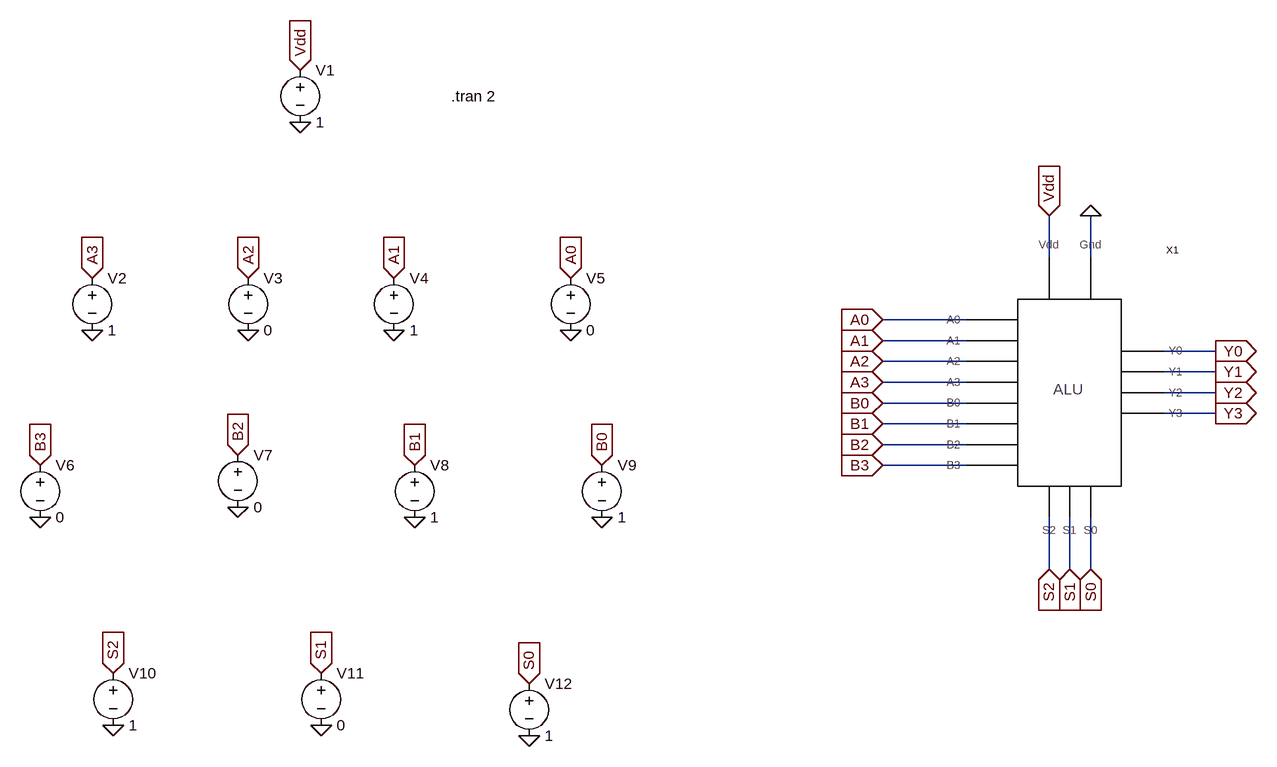
[diagram p0: schematic ALU_Test.asc]
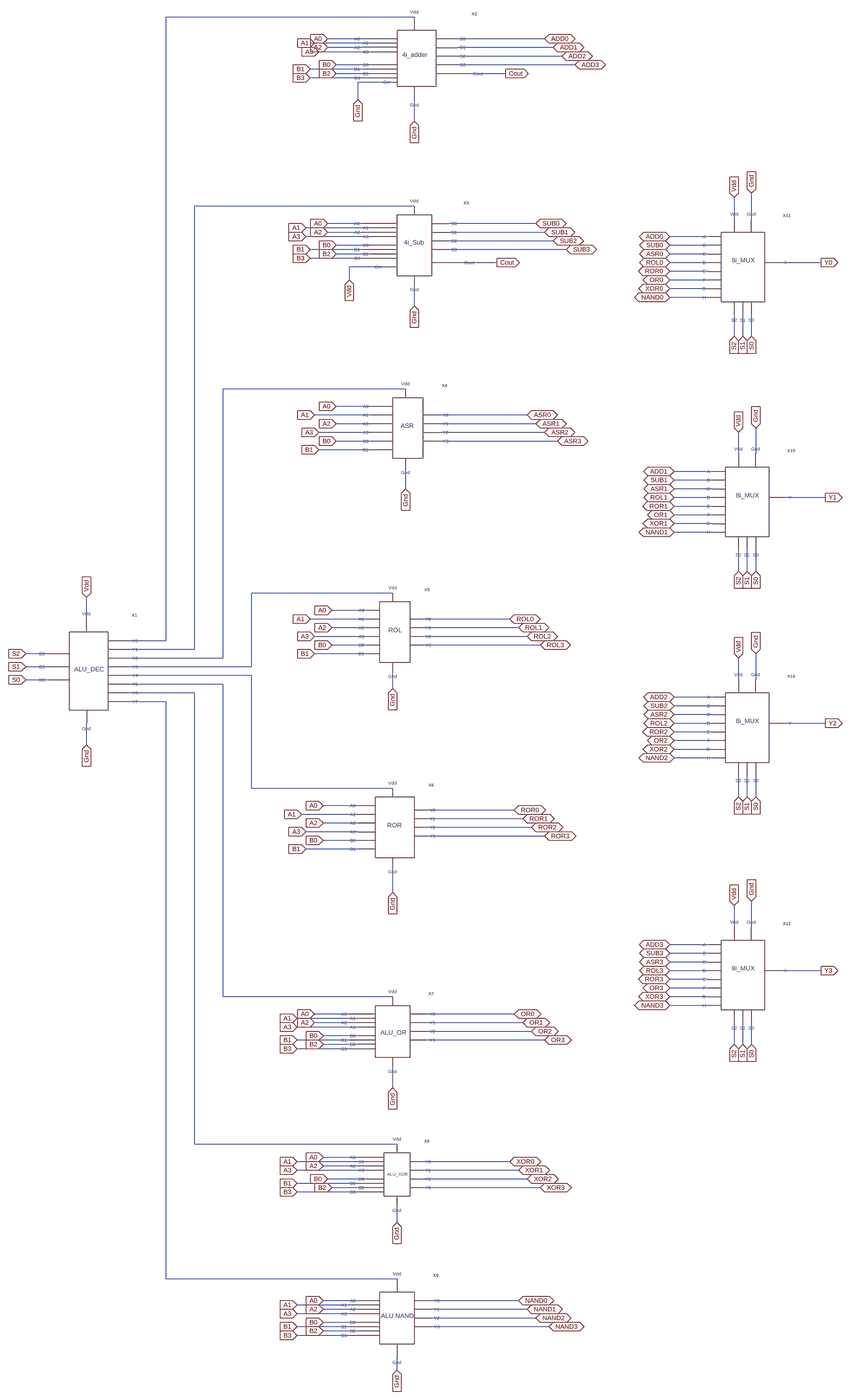
[diagram p1: sub-circuit alu.asc, whole sheet]
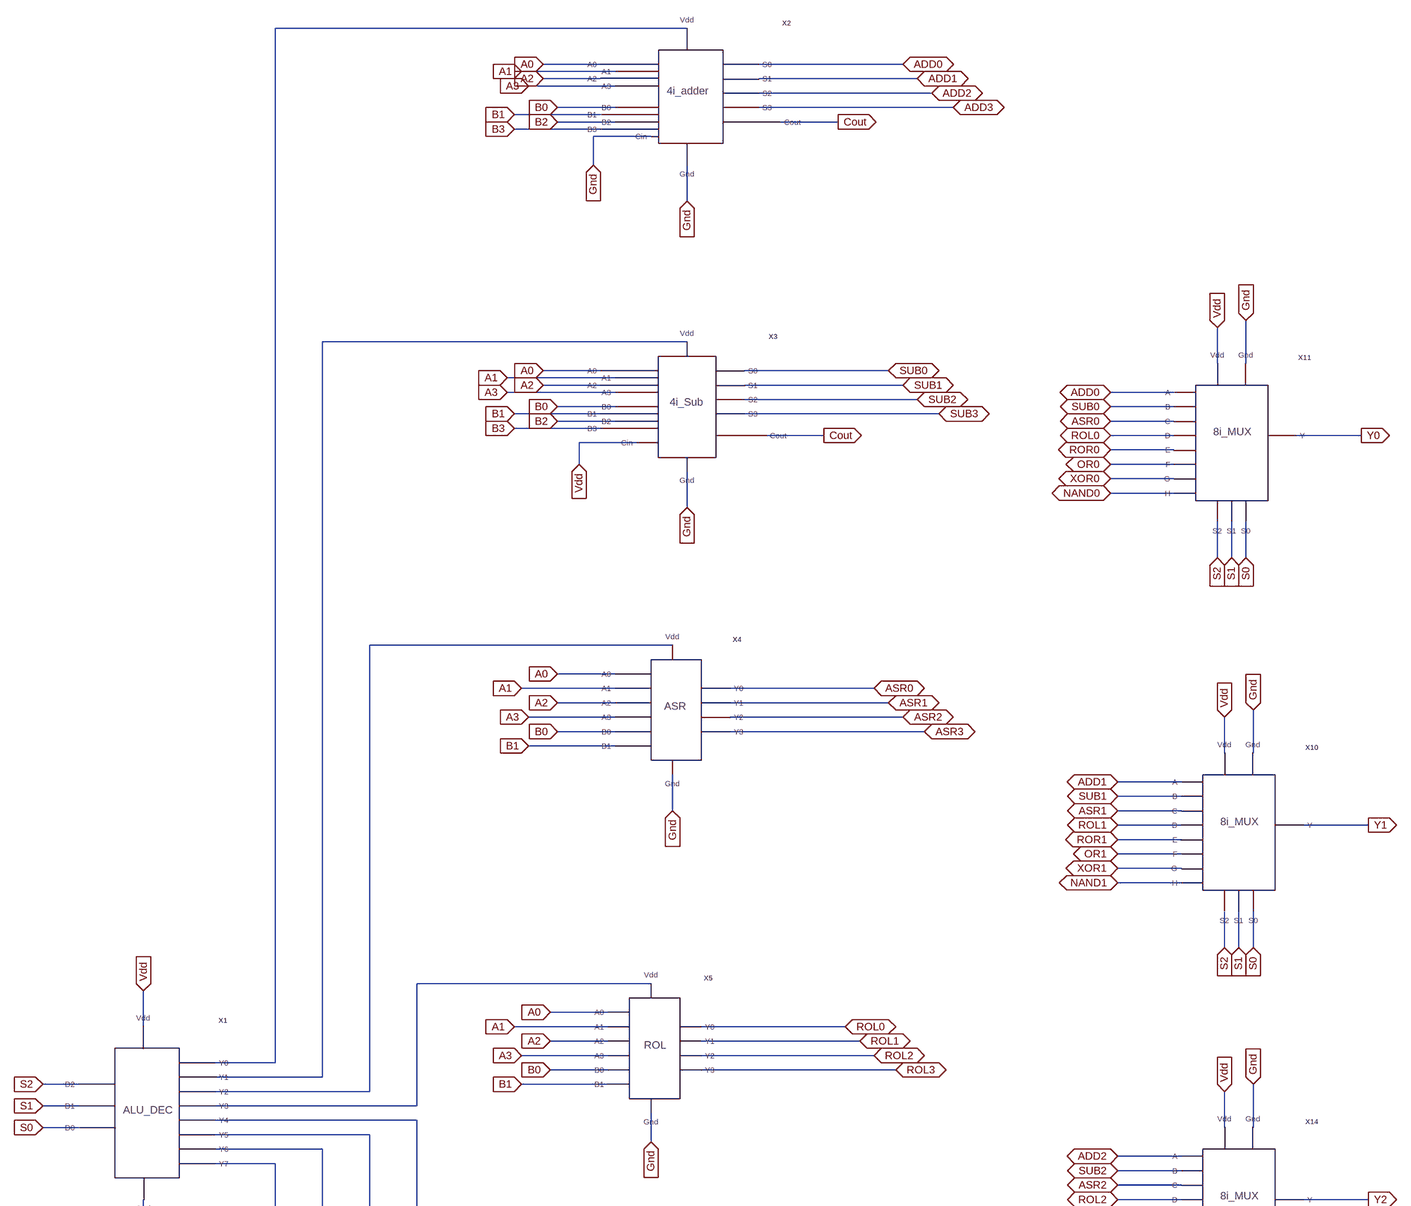
[diagram p2: sub-circuit alu.asc, part, row 1 of 2, column 1 of 1]
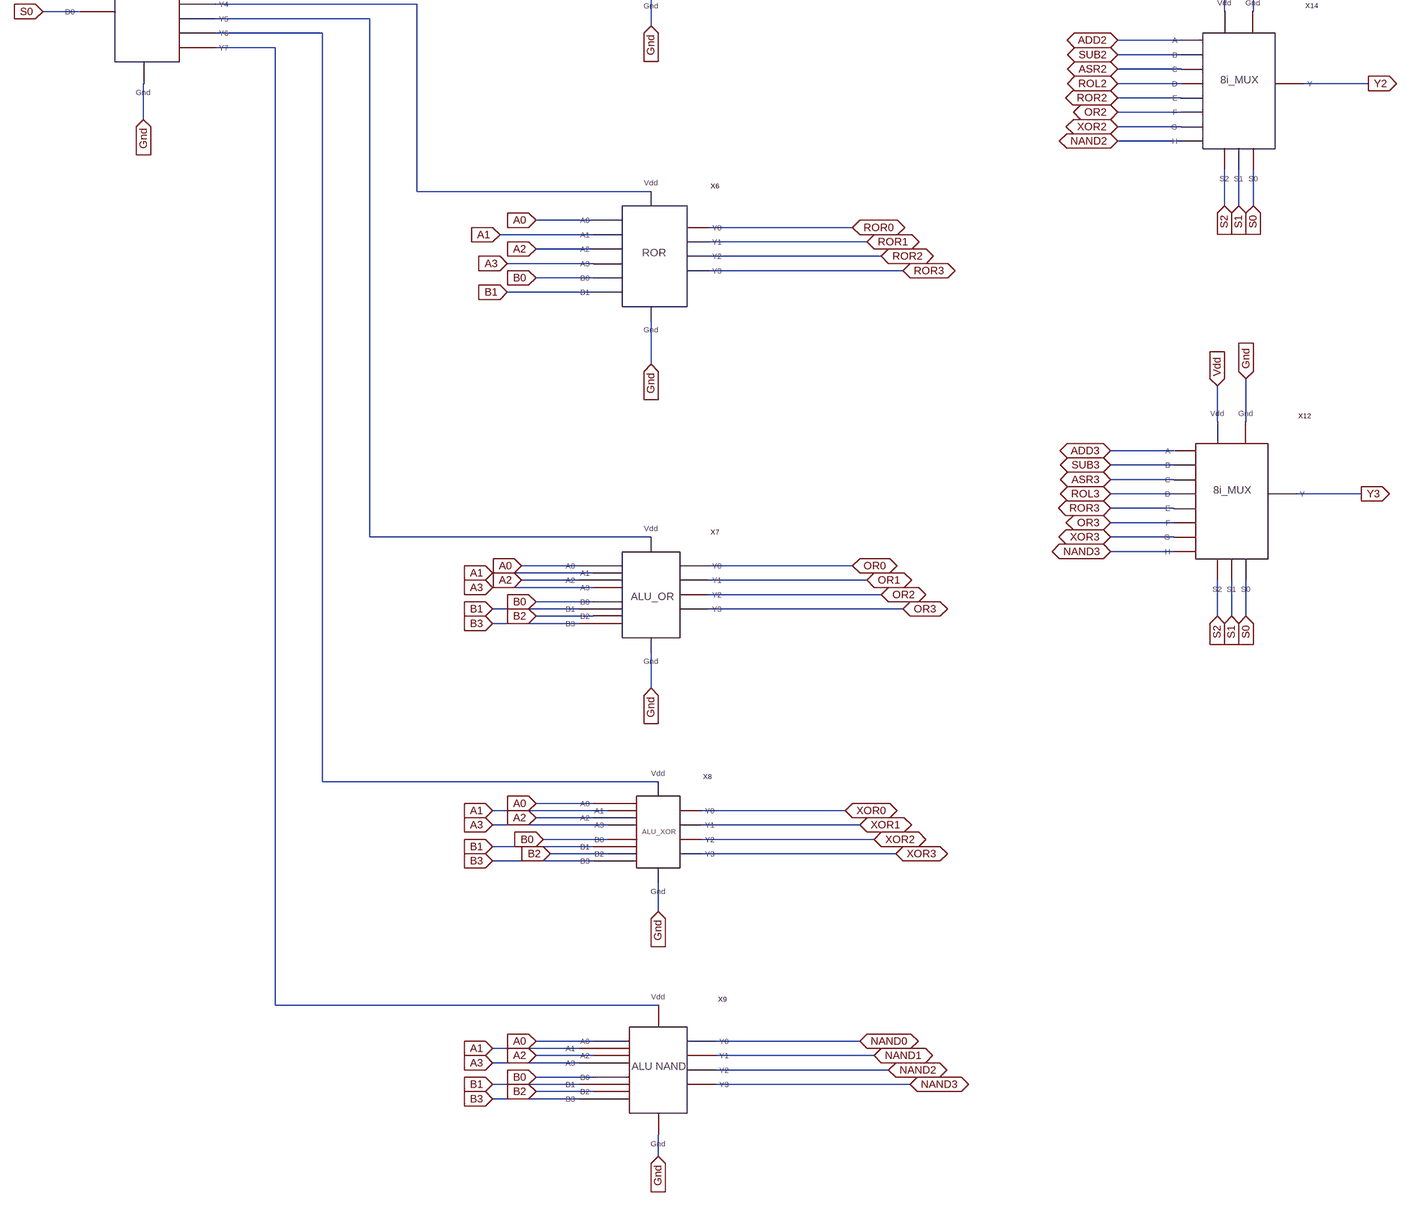
[diagram p3: sub-circuit alu.asc, part, row 2 of 2, column 1 of 1]
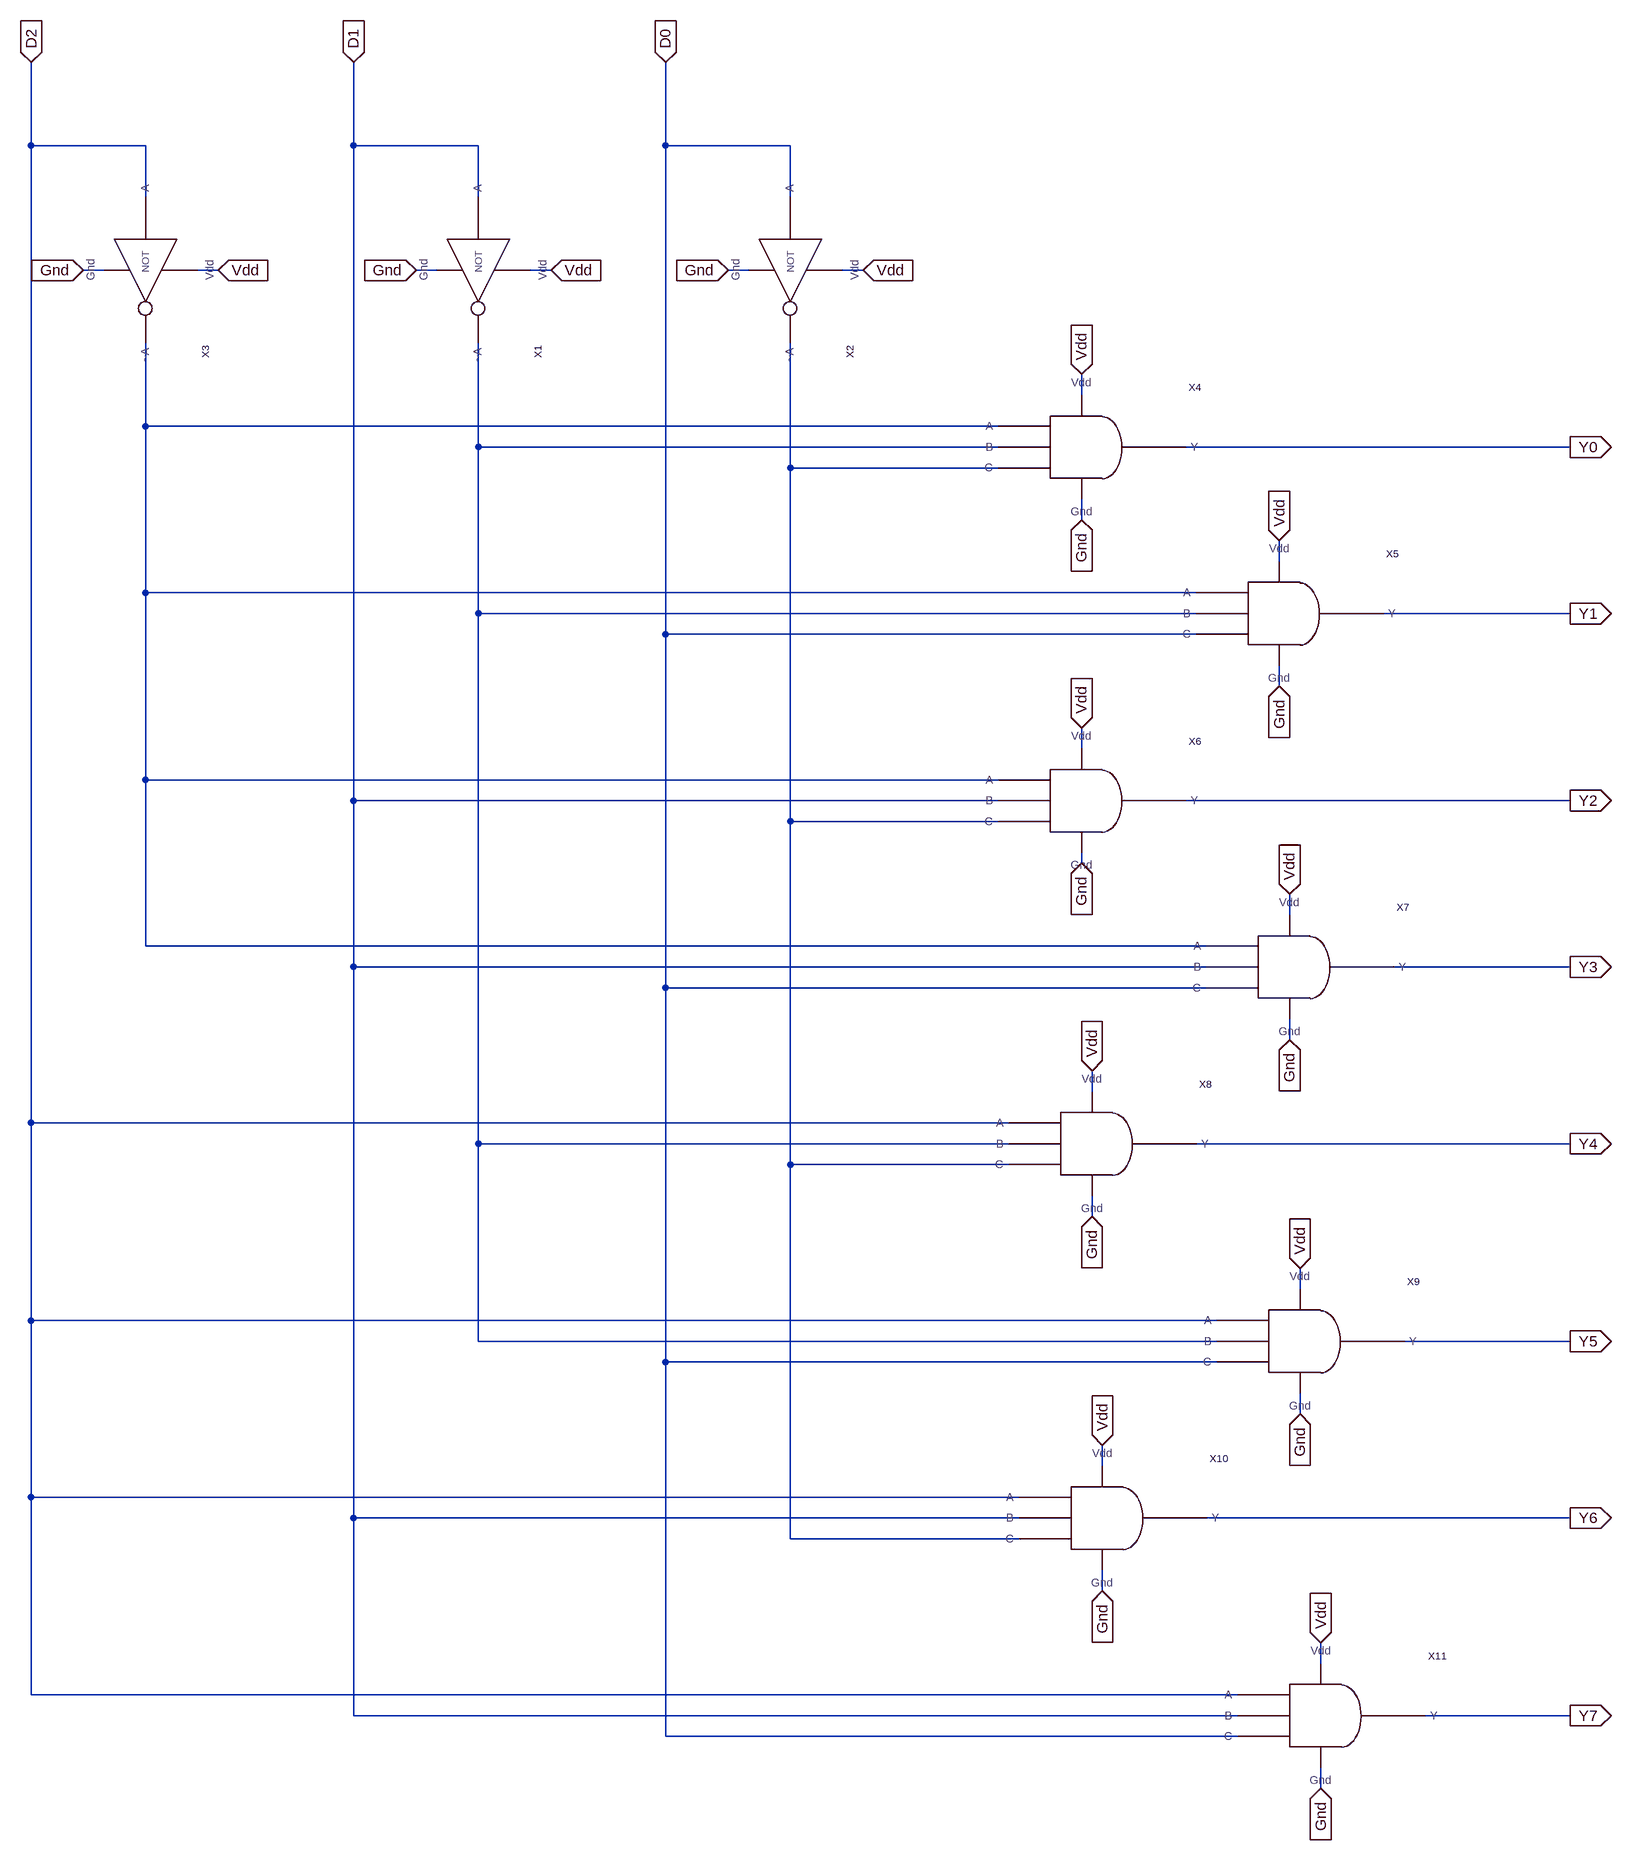
[diagram p4: sub-circuit alu_dec.asc]
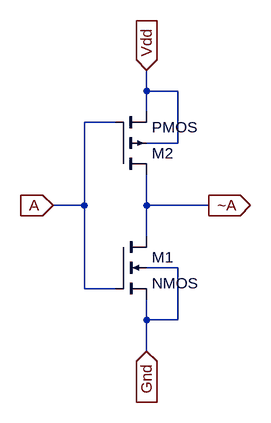
[diagram p5: sub-circuit not.asc]
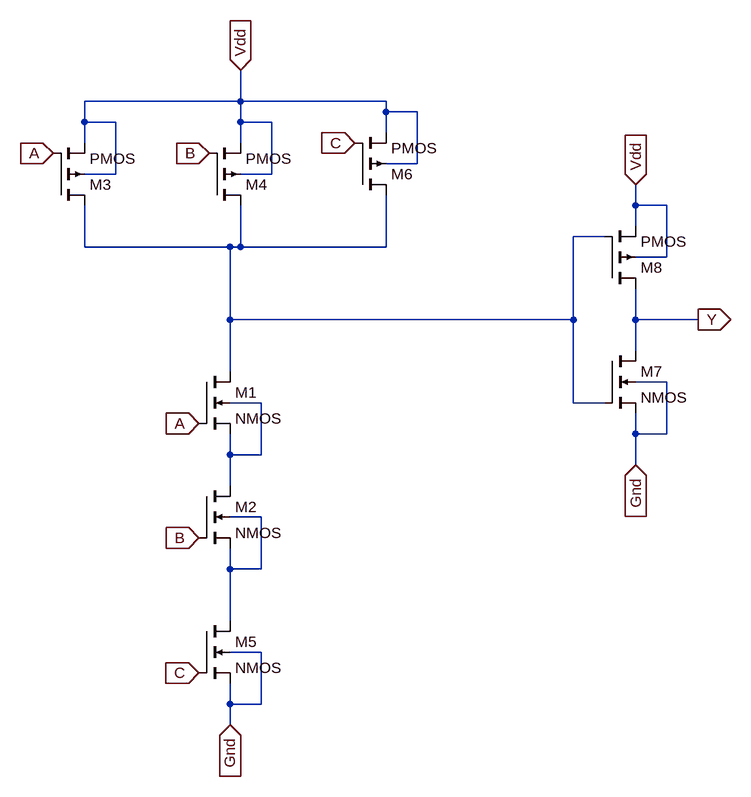
[diagram p6: sub-circuit 3iand.asc]
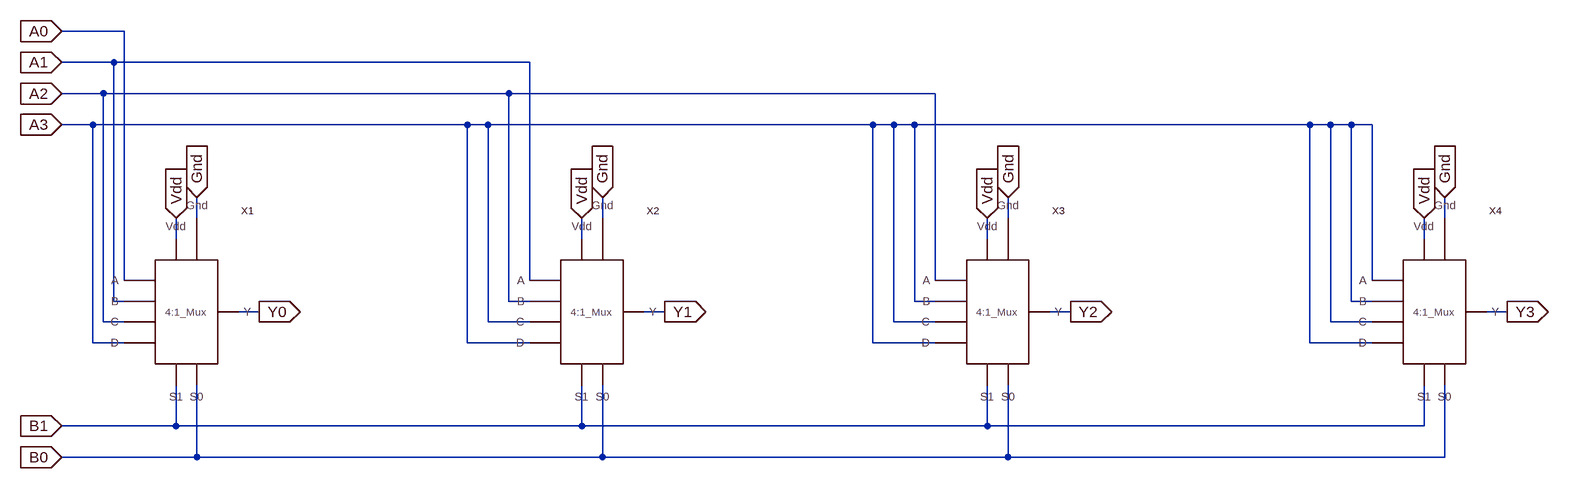
[diagram p7: sub-circuit alu_asr.asc]
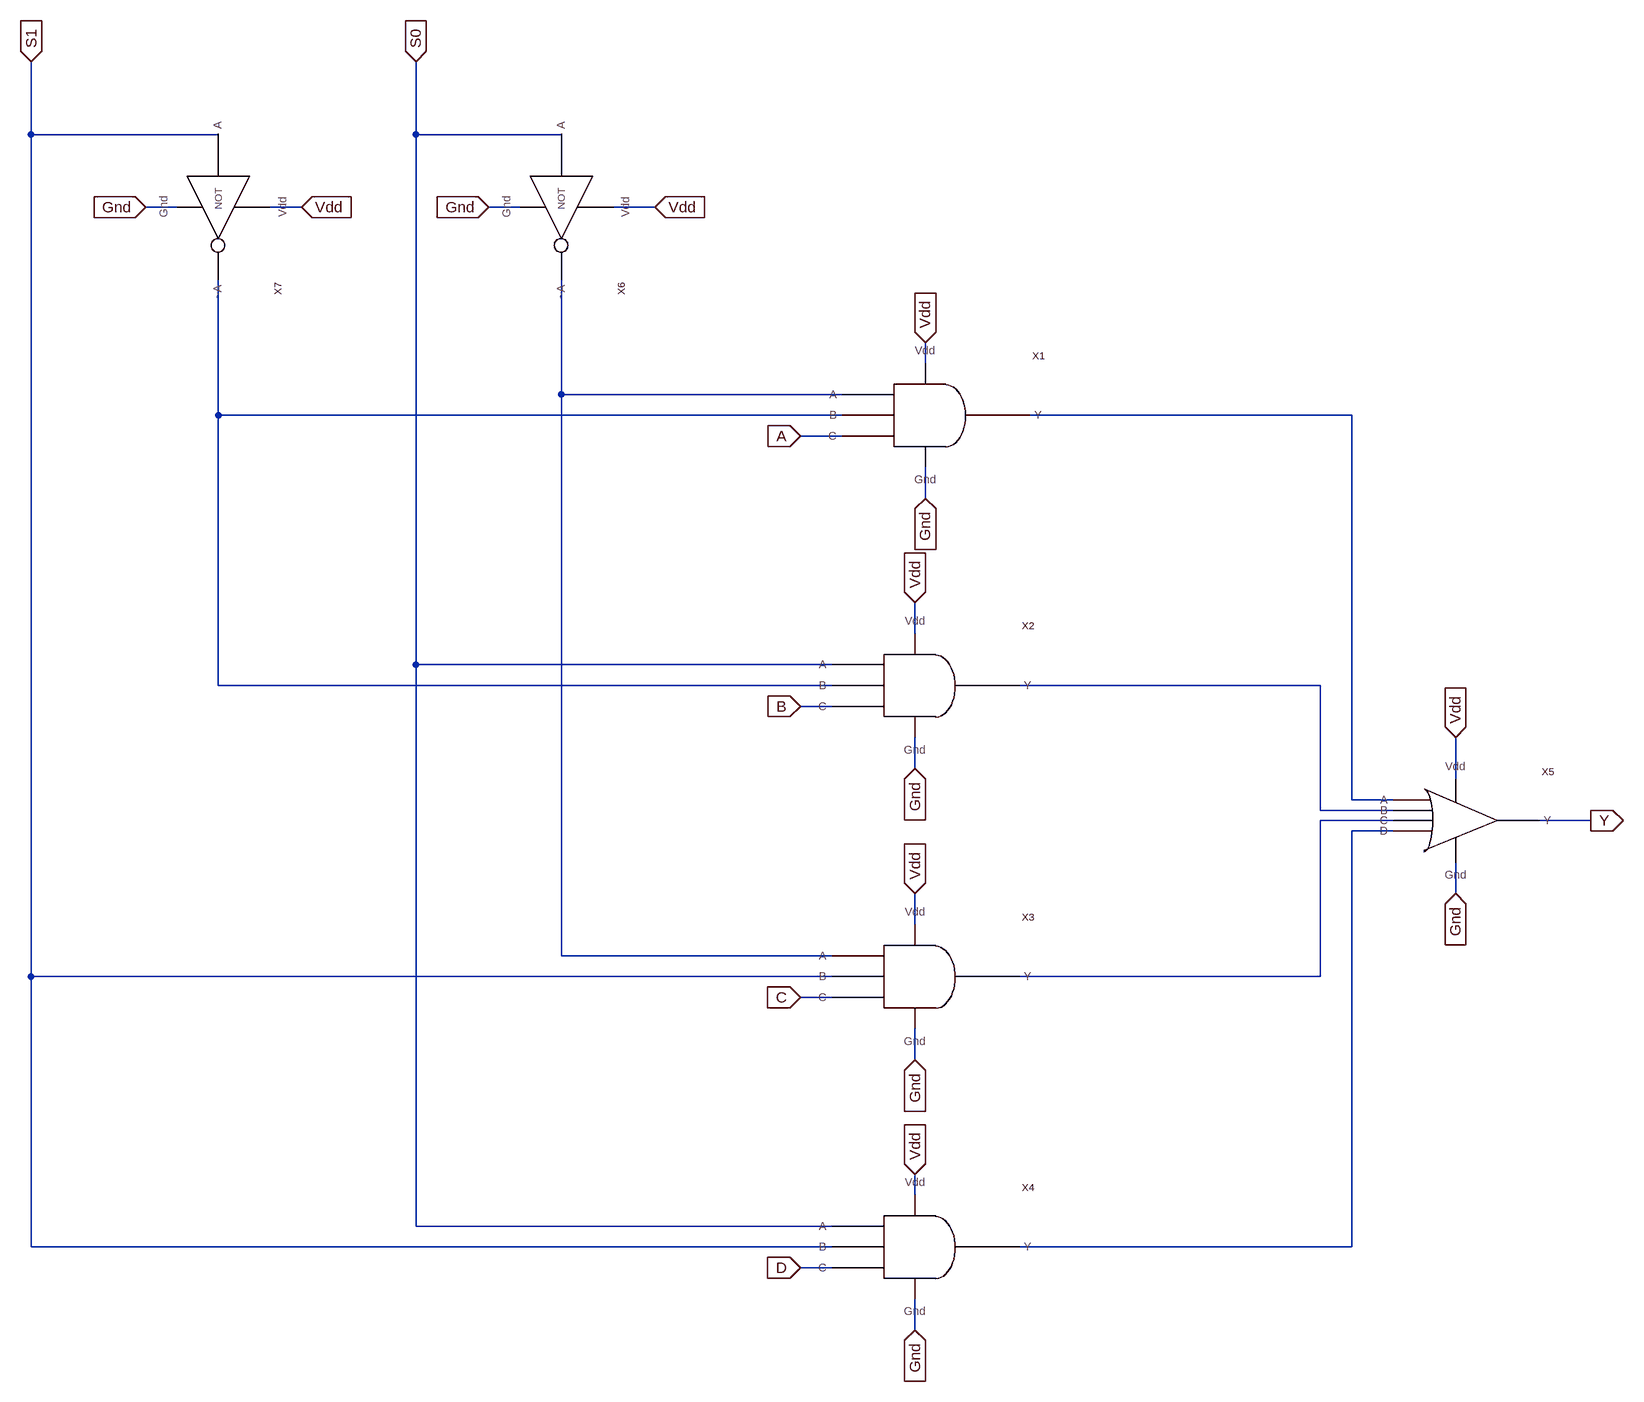
[diagram p8: sub-circuit 41_mux.asc]
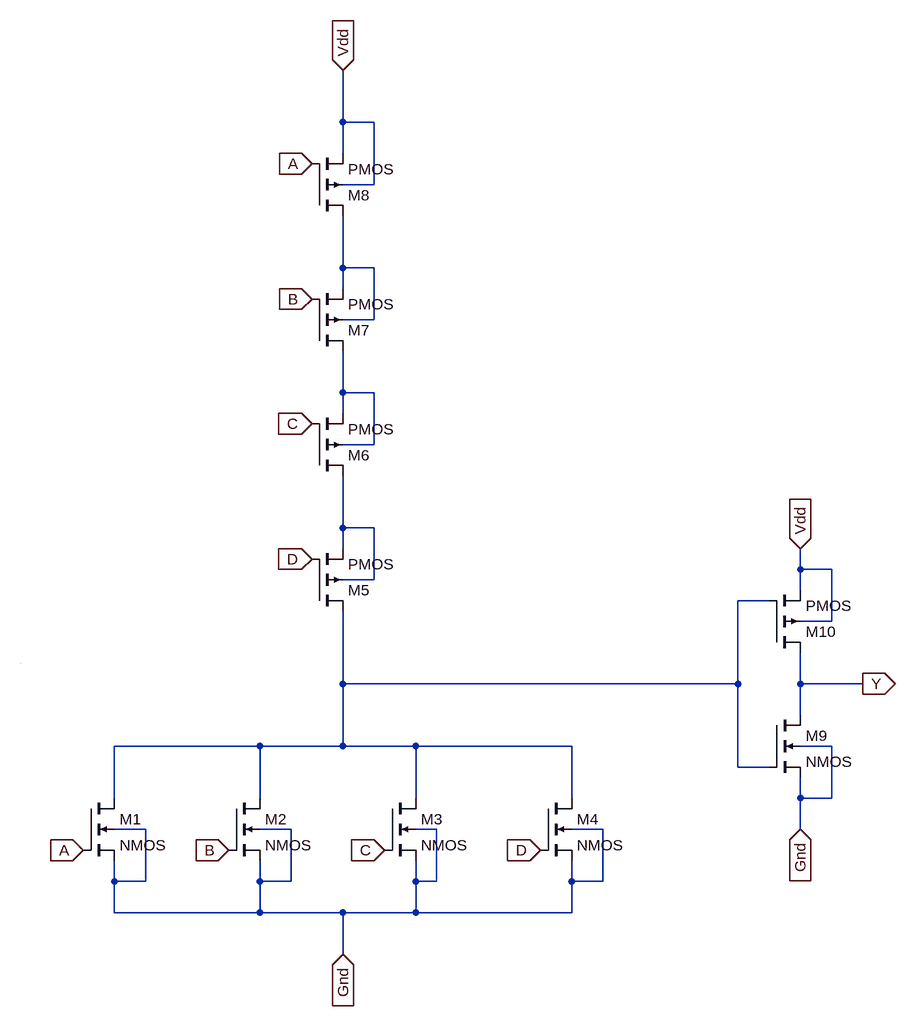
[diagram p9: sub-circuit 4i_or.asc]
ALU_Test.asc, the LTspice schematic file:
Version 4
SHEET 1 880 868
WIRE 368 -32 368 -96
WIRE 432 -32 432 -96
WIRE 240 64 112 64
WIRE 240 96 112 96
WIRE 624 112 544 112
WIRE 240 128 112 128
WIRE 624 144 544 144
WIRE 240 160 112 160
WIRE 624 176 544 176
WIRE 240 192 112 192
WIRE 624 208 544 208
WIRE 240 224 112 224
WIRE 240 256 112 256
WIRE 240 288 112 288
WIRE 368 448 368 368
WIRE 400 448 400 368
WIRE 432 448 432 368
FLAG -784 -320 Vdd
IOPIN -784 -320 In
FLAG -368 0 A0
IOPIN -368 0 In
FLAG -640 0 A1
IOPIN -640 0 In
FLAG -864 0 A2
IOPIN -864 0 In
FLAG -1104 0 A3
IOPIN -1104 0 In
FLAG -784 -240 0
FLAG -1104 80 0
FLAG -864 80 0
FLAG -640 80 0
FLAG -368 80 0
FLAG -608 288 B1
IOPIN -608 288 In
FLAG -880 272 B2
IOPIN -880 272 In
FLAG -1184 288 B3
IOPIN -1184 288 In
FLAG -320 288 B0
IOPIN -320 288 In
FLAG -1184 368 0
FLAG -880 352 0
FLAG -608 368 0
FLAG -320 368 0
FLAG -432 624 S0
IOPIN -432 624 In
FLAG -752 608 S1
IOPIN -752 608 In
FLAG -1072 608 S2
IOPIN -1072 608 In
FLAG -1072 688 0
FLAG -752 688 0
FLAG -432 704 0
FLAG 368 -96 Vdd
IOPIN 368 -96 In
FLAG 112 64 A0
IOPIN 112 64 In
FLAG 112 96 A1
IOPIN 112 96 In
FLAG 112 128 A2
IOPIN 112 128 In
FLAG 112 160 A3
IOPIN 112 160 In
FLAG 112 192 B0
IOPIN 112 192 In
FLAG 112 224 B1
IOPIN 112 224 In
FLAG 112 256 B2
IOPIN 112 256 In
FLAG 112 288 B3
IOPIN 112 288 In
FLAG 432 448 S0
IOPIN 432 448 In
FLAG 400 448 S1
IOPIN 400 448 In
FLAG 368 448 S2
IOPIN 368 448 In
FLAG 624 112 Y0
IOPIN 624 112 Out
FLAG 624 144 Y1
IOPIN 624 144 Out
FLAG 624 176 Y2
IOPIN 624 176 Out
FLAG 624 208 Y3
IOPIN 624 208 Out
FLAG 432 -96 0
SYMBOL ALU 400 96 R0
SYMATTR InstName X1
SYMBOL voltage -784 -336 R0
WINDOW 123 0 0 Left 0
WINDOW 39 0 0 Left 0
SYMATTR InstName V1
SYMATTR Value 1
SYMBOL voltage -1104 -16 R0
WINDOW 123 0 0 Left 0
WINDOW 39 0 0 Left 0
SYMATTR InstName V2
SYMATTR Value 1
SYMBOL voltage -864 -16 R0
WINDOW 123 0 0 Left 0
WINDOW 39 0 0 Left 0
SYMATTR InstName V3
SYMATTR Value 0
SYMBOL voltage -640 -16 R0
WINDOW 123 0 0 Left 0
WINDOW 39 0 0 Left 0
SYMATTR InstName V4
SYMATTR Value 1
SYMBOL voltage -368 -16 R0
WINDOW 123 0 0 Left 0
WINDOW 39 0 0 Left 0
SYMATTR InstName V5
SYMATTR Value 0
SYMBOL voltage -1184 272 R0
WINDOW 123 0 0 Left 0
WINDOW 39 0 0 Left 0
SYMATTR InstName V6
SYMATTR Value 0
SYMBOL voltage -880 256 R0
WINDOW 123 0 0 Left 0
WINDOW 39 0 0 Left 0
SYMATTR InstName V7
SYMATTR Value 0
SYMBOL voltage -608 272 R0
WINDOW 123 0 0 Left 0
WINDOW 39 0 0 Left 0
SYMATTR InstName V8
SYMATTR Value 1
SYMBOL voltage -320 272 R0
WINDOW 123 0 0 Left 0
WINDOW 39 0 0 Left 0
SYMATTR InstName V9
SYMATTR Value 1
SYMBOL voltage -1072 592 R0
WINDOW 123 0 0 Left 0
WINDOW 39 0 0 Left 0
SYMATTR InstName V10
SYMATTR Value 1
SYMBOL voltage -752 592 R0
WINDOW 123 0 0 Left 0
WINDOW 39 0 0 Left 0
SYMATTR InstName V11
SYMATTR Value 0
SYMBOL voltage -432 608 R0
WINDOW 123 0 0 Left 0
WINDOW 39 0 0 Left 0
SYMATTR InstName V12
SYMATTR Value 1
TEXT -552 -280 Left 2 !.tran 2

The netlist it stands for:
* ALU_Test.asc
XX1 A0 A1 A2 A3 B0 B1 B2 B3 S0 S1 S2 Vdd 0 Y0 Y1 Y2 Y3 alu
V1 Vdd 0 1
V2 A3 0 1
V3 A2 0 0
V4 A1 0 1
V5 A0 0 0
V6 B3 0 0
V7 B2 0 0
V8 B1 0 1
V9 B0 0 1
V10 S2 0 1
V11 S1 0 0
V12 S0 0 1

* block symbol definitions
.subckt alu A0 A1 A2 A3 B0 B1 B2 B3 S0 S1 S2 Vdd Gnd Y0 Y1 Y2 Y3
XX1 S0 S1 S2 Vdd Gnd N001 N002 N003 N004 N005 N006 N007 N008 alu_dec
XX2 A0 A1 A2 A3 B0 B1 B2 B3 Gnd N001 ADD0 ADD1 ADD2 ADD3 Cout Gnd ALU_ADD  ; pins A0 A1 A2 A3 B0 B1 B2 B3 Gnd Vdd S0 S1 S2 S3 Cout Cin
XX3 A0 A1 A2 A3 B0 B1 B2 B3 Vdd N002 Gnd SUB0 SUB1 SUB2 SUB3 Cout ALU_SUB  ; pins A0 A1 A2 A3 B0 B1 B2 B3 Cin Vdd Gnd S0 S1 S2 S3 Cout
XX4 A0 A1 A2 A3 B0 B1 N003 Gnd ASR0 ASR1 ASR2 ASR3 alu_asr
XX5 A0 A1 A2 A3 B0 B1 N004 Gnd ROL0 ROL1 ROL2 ROL3 alu_rol
XX6 A0 A1 A2 A3 B0 B1 Gnd N005 ROR0 ROR1 ROR2 ROR3 alu_ror
XX7 A0 A1 A2 A3 B0 B1 B2 B3 N006 Gnd OR0 OR1 OR2 OR3 alu_or
XX8 A0 A1 A2 A3 B0 B1 B2 B3 N007 Gnd XOR0 XOR1 XOR2 XOR3 alu_xor
XX9 A0 A1 A2 A3 B0 B1 B2 B3 NAND0 NAND1 NAND2 NAND3 N008 Gnd alu_nand
XX11 ADD0 SUB0 ASR0 ROL0 ROR0 OR0 XOR0 NAND0 S0 S1 S2 Y0 Vdd Gnd alu_mux
XX10 ADD1 SUB1 ASR1 ROL1 ROR1 OR1 XOR1 NAND1 S0 S1 S2 Y1 Vdd Gnd alu_mux
XX14 ADD2 SUB2 ASR2 ROL2 ROR2 OR2 XOR2 NAND2 S0 S1 S2 Y2 Vdd Gnd alu_mux
XX12 ADD3 SUB3 ASR3 ROL3 ROR3 OR3 XOR3 NAND3 S0 S1 S2 Y3 Vdd Gnd alu_mux
.ends alu

.subckt alu_dec D0 D1 D2 Vdd Gnd Y0 Y1 Y2 Y3 Y4 Y5 Y6 Y7
XX1 D1 N002 Vdd Gnd not
XX2 D0 N003 Vdd Gnd not
XX3 D2 N001 Vdd Gnd not
XX4 N001 N002 N003 Vdd Gnd Y0 3iand
XX5 N001 N002 D0 Vdd Gnd Y1 3iand
XX6 N001 D1 N003 Vdd Gnd Y2 3iand
XX7 N001 D1 D0 Vdd Gnd Y3 3iand
XX8 D2 N002 N003 Vdd Gnd Y4 3iand
XX9 D2 N002 D0 Vdd Gnd Y5 3iand
XX10 D2 D1 N003 Vdd Gnd Y6 3iand
XX11 D2 D1 D0 Vdd Gnd Y7 3iand
.ends alu_dec

.subckt not A ~A Vdd Gnd
M1 ~A A Gnd Gnd NMOS
M2 ~A A Vdd Vdd PMOS
.ends not

.subckt 3iand A B C Vdd Gnd Y
M1 N001 A N002 N002 NMOS
M2 N002 B N003 N003 NMOS
M3 N001 A Vdd Vdd PMOS
M4 N001 B Vdd Vdd PMOS
M5 N003 C Gnd Gnd NMOS
M6 N001 C Vdd Vdd PMOS
M7 Y N001 Gnd Gnd NMOS
M8 Y N001 Vdd Vdd PMOS
.ends 3iand

.subckt alu_asr A0 A1 A2 A3 B0 B1 Vdd Gnd Y0 Y1 Y2 Y3
XX1 A0 A1 A2 A3 B0 B1 Y0 Vdd Gnd 41_mux
XX2 A1 A2 A3 A3 B0 B1 Y1 Vdd Gnd 41_mux
XX3 A2 A3 A3 A3 B0 B1 Y2 Vdd Gnd 41_mux
XX4 A3 A3 A3 A3 B0 B1 Y3 Vdd Gnd 41_mux
.ends alu_asr

.subckt 41_mux A B C D S0 S1 Y Vdd Gnd
XX1 N001 N002 A Vdd Gnd N003 3iand
XX2 S0 N002 B Vdd Gnd N004 3iand
XX3 N001 S1 C Vdd Gnd N005 3iand
XX4 S0 S1 D Vdd Gnd N006 3iand
XX5 N003 N004 N005 N006 Vdd Gnd Y 4i_or
XX6 S0 N001 Vdd Gnd not
XX7 S1 N002 Vdd Gnd not
.ends 41_mux

.subckt 4i_or A B C D Vdd Gnd Y
M1 N004 A Gnd Gnd NMOS
M2 N004 B Gnd Gnd NMOS
M3 N004 C Gnd Gnd NMOS
M4 N004 D Gnd Gnd NMOS
M5 N004 D N003 N003 PMOS
M6 N003 C N002 N002 PMOS
M7 N002 B N001 N001 PMOS
M8 N001 A Vdd Vdd PMOS
M9 Y N004 Gnd Gnd NMOS
M10 Y N004 Vdd Vdd PMOS
.ends 4i_or

.subckt alu_rol A0 A1 A2 A3 B0 B1 Vdd Gnd Y0 Y1 Y2 Y3
XX1 A0 A3 A2 A1 B0 B1 Y0 Vdd Gnd 41_mux
XX2 A1 A0 A3 A2 B0 B1 Y1 Vdd Gnd 41_mux
XX3 A2 A1 A0 A3 B0 B1 Y2 Vdd Gnd 41_mux
XX4 A3 A2 A1 A0 B0 B1 Y3 Vdd Gnd 41_mux
.ends alu_rol

.subckt alu_ror A0 A1 A2 A3 B0 B1 Gnd Vdd Y0 Y1 Y2 Y3
XX1 A0 A1 A2 A3 B0 B1 Y0 Vdd Gnd 41_mux
XX2 A1 A2 A3 A0 B0 B1 Y1 Vdd Gnd 41_mux
XX3 A2 A3 A0 A1 B0 B1 Y2 Vdd Gnd 41_mux
XX4 A3 A0 A1 A2 B0 B1 Y3 Vdd Gnd 41_mux
.ends alu_ror

.subckt alu_or A0 A1 A2 A3 B0 B1 B2 B3 Vdd Gnd Y0 Y1 Y2 Y3
XX1 Vdd Y1 Gnd A1 B1 or
XX2 Vdd Y0 Gnd A0 B0 or
XX3 Vdd Y2 Gnd A2 B2 or
XX4 Vdd Y3 Gnd A3 B3 or
.ends alu_or

.subckt or Vdd Y Gnd A B
M1 N002 A Gnd Gnd NMOS
M2 N002 B Gnd Gnd NMOS
M3 N001 A Vdd Vdd PMOS
M4 N002 B N001 N001 PMOS
M5 Y N002 Gnd Gnd NMOS
M6 Y N002 Vdd Vdd PMOS
.ends or

.subckt alu_xor A0 A1 A2 A3 B0 B1 B2 B3 Vdd Gnd Y0 Y1 Y2 Y3
XX1 Vdd Gnd A0 B0 Y0 XOR1  ; pins Vdd Gnd A B Y
XX2 Vdd Gnd A1 B1 Y1 XOR1  ; pins Vdd Gnd A B Y
XX3 Vdd Gnd A2 B2 Y2 XOR1  ; pins Vdd Gnd A B Y
XX4 Vdd Gnd A3 B3 Y3 XOR1  ; pins Vdd Gnd A B Y
.ends alu_xor

.subckt alu_nand A0 A1 A2 A3 B0 B1 B2 B3 Y0 Y1 Y2 Y3 Vdd Gnd
XX1 A0 B0 Vdd Gnd Y0 nand
XX2 A1 B1 Vdd Gnd Y1 nand
XX3 A2 B2 Vdd Gnd Y2 nand
XX4 A3 B3 Vdd Gnd Y3 nand
.ends alu_nand

.subckt nand A B Vdd Gnd Y
M1 Y A N001 N001 NMOS
M2 N001 B Gnd Gnd NMOS
M3 Y A Vdd Vdd PMOS
M4 Y B Vdd Vdd PMOS
.ends nand

.subckt alu_mux A B C D E F G H S0 S1 S2 Y Vdd Gnd
XX1 B N001 N003 S0 Vdd Gnd N005 4iand
XX2 C N001 S1 N004 Vdd Gnd N006 4iand
XX3 D N001 S1 S0 Vdd Gnd N007 4iand
XX4 E N003 S2 N004 Vdd Gnd N008 4iand
XX5 F S2 N003 S0 Vdd Gnd N009 4iand
XX6 G S2 S1 N004 Vdd Gnd N010 4iand
XX7 H S2 S1 S0 Vdd Gnd N011 4iand
XX8 A N001 N003 N004 Vdd Gnd N002 4iand
XX9 S0 N004 Vdd Gnd not
XX10 S1 N003 Vdd Gnd not
XX11 S2 N001 Vdd Gnd not
XX12 N002 N005 N006 N007 N008 N009 N010 N011 Vdd Gnd Y 8i_or
.ends alu_mux

.subckt 4iand A B C D Vdd Gnd Y
M1 N001 A N002 N002 NMOS
M2 N002 B N003 N003 NMOS
M3 N001 A Vdd Vdd PMOS
M4 N001 B Vdd Vdd PMOS
M5 N003 C N004 N004 NMOS
M6 N001 C Vdd Vdd PMOS
M7 Y N001 Gnd Gnd NMOS
M8 Y N001 Vdd Vdd PMOS
M9 N004 D Gnd Gnd NMOS
M10 N001 D Vdd Vdd PMOS
.ends 4iand

.subckt 8i_or A B C D E F G H Vdd Gnd Y
M1 N008 E Gnd Gnd NMOS
M2 N008 F Gnd Gnd NMOS
M3 N008 G Gnd Gnd NMOS
M4 N008 H Gnd Gnd NMOS
M5 N008 H N007 N007 PMOS
M6 N007 G N006 N006 PMOS
M7 N006 F N005 N005 PMOS
M8 N005 E N004 N004 PMOS
M9 Y N008 Gnd Gnd NMOS
M10 Y N008 Vdd Vdd PMOS
M11 N004 D N003 N003 PMOS
M12 N003 C N002 N002 PMOS
M13 N002 B N001 N001 PMOS
M14 N001 A Vdd Vdd PMOS
M15 N008 A Gnd Gnd NMOS
M16 N008 B Gnd Gnd NMOS
M17 N008 C Gnd Gnd NMOS
M18 N008 D Gnd Gnd NMOS
.ends 8i_or

.model NMOS NMOS
.model PMOS PMOS
.lib standard.mos
.tran 2
.backanno
.end